# Altium schematic sheet Lithium Battery Charger.SchDoc
size A4; Organization: TESLA Motors, INC; Address1: 3500 Deer Creek Road; Address2: Palo Alto, CA; Address4: U.S.A.; SheetNumber: 5; SheetTotal: 21
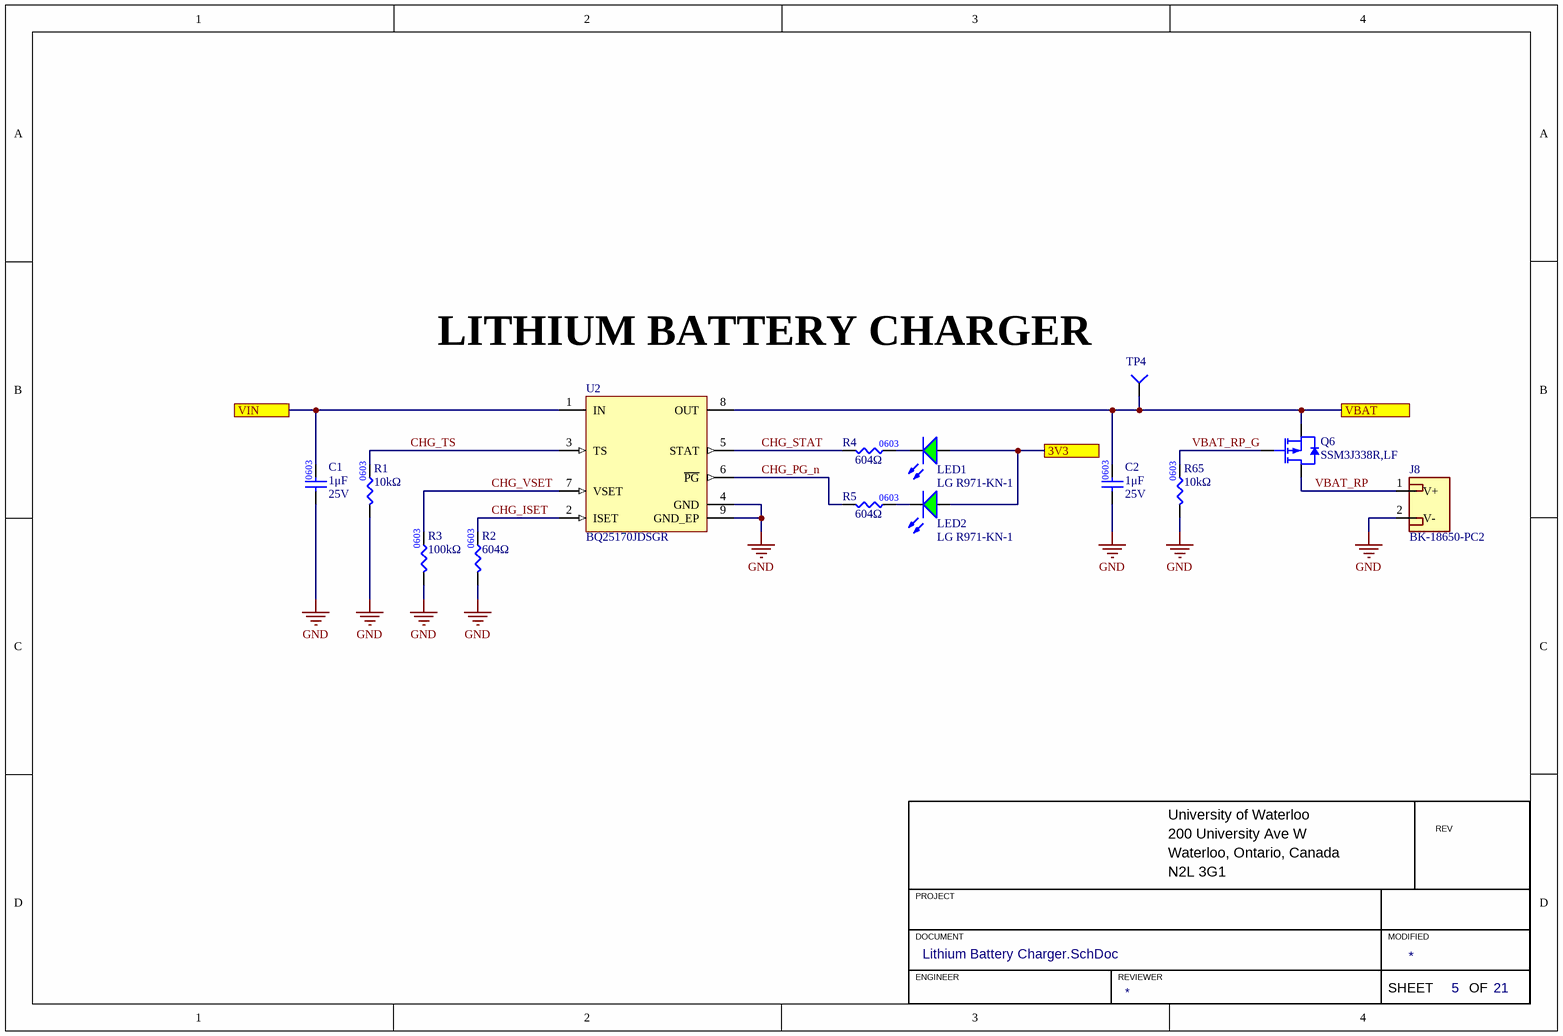
[diagram p0: Lithium Battery Charger.SchDoc]

## Parts
C1  value 1μF  Voltage Rating: 25V  [CAP0603]  (hidden comment: CAP_1uF_25V_0603)
C2  value 1μF  Voltage Rating: 25V  [CAP0603]  (hidden comment: CAP_1uF_25V_0603)
J8  Manufacturer Part Number 1: BK-18650-PC2  [MPD_18650-PC2]  (hidden comment: CON_2POS_XT90)
LED1  Manufacturer Part Number 1: LG R971-KN-1  [LED_0805_GREEN]  (hidden comment: LED_GREEN_0805)
LED2  Manufacturer Part Number 1: LG R971-KN-1  [LED_0805_GREEN]  (hidden comment: LED_GREEN_0805)
Q6  Manufacturer Part Number 1: SSM3J338R,LF  [DIO-INC_SOT23]  (hidden comment: PMOS_12V_6A)
R1  value 10kΩ  [RES0603]  (hidden comment: RES_10kΩ_0603_1%)
R2  value 604Ω  [RES0603]  (hidden comment: RES_604Ω_0603_1%)
R3  value 100kΩ  [RES0603]  (hidden comment: RES_100kΩ_0603_1%)
R4  value 604Ω  [RES0603]  (hidden comment: RES_604Ω_0603_1%)
R5  value 604Ω  [RES0603]  (hidden comment: RES_604Ω_0603_1%)
R65  value 10kΩ  [RES0603]  (hidden comment: RES_10kΩ_0603_1%)
TP4  TESTPOINT_KEYSTONE_LOOP  [KEYSTONE_5019]  (value not drawn)
U2  BQ25170JDSGR  [TI_8-WSON]

## Ports
3V3, VBAT, VIN

## Nets
GND: C1.1 C2.1 J8.2(V-) R1.1 R2.1 R3.1 R65.1 U2.4(GND) U2.9(GND_EP)
3V3: LED1.1(A) LED2.1(A) ; port 3V3
CHG_ISET: R2.2 U2.2(ISET)
CHG_PG_n: R5.1 U2.6(~{PG})
CHG_STAT: R4.1 U2.5(STAT)
CHG_TS: R1.2 U2.3(TS)
CHG_VSET: R3.2 U2.7(VSET)
VBAT: C2.2 Q6.2(Source) TP4.1(=value) U2.8(OUT) ; port VBAT
VBAT_RP: J8.1(V+) Q6.3(Drain)
VBAT_RP_G: Q6.1(Gate) R65.2
VIN: C1.2 U2.1(IN) ; port VIN
NetLED1_2: LED1.2(K) R4.2
NetLED2_2: LED2.2(K) R5.2

## Notes on the sheet
- LITHIUM BATTERY CHARGER
- University of Waterloo
- 200 University Ave W
- REV
- PROJECT
- Waterloo, Ontario, Canada
- N2L 3G1
- DOCUMENT
- ENGINEER
- REVIEWER
- MODIFIED
- SHEET
- OF
- (in symbol RES_100kΩ_0603_1%) 0603
- (in symbol RES_604Ω_0603_1%) 0603

## Library data of the parts
C1 C2 = CAP_1uF_25V_0603: CAP CER 1UF 25V X5R 0603; Manufacturer 1: Samsung; Manufacturer Part Number 1: CL10A105KA8NNNC; Supplier 1: Digi-Key; Mounting Type: SMD; Package: 0603; Supplier Part Number 1: 1276-1102-1-ND; Dielectric: X5R
J8 = CON_2POS_18650: BATTERY HOLDER 18650 PC PIN; Manufacturer 1: MPD (Memory Protection Devices); Mounting Type: TH; Supplier 1: Digi-Key; Supplier Part Number 1: BK-18650-PC2-ND
LED1 LED2 = LED_GREEN_0805: LED GREEN DIFFUSED 0805 SMD; Manufacturer 1: OSRAM; Forward Voltage Drop: 2.2V; Package/Footprint: 0805; Supplier Part Number 1: 475-1410-1-ND; Supplier 1: Digi-Key; Mounting Type: SMD
Q6 = PMOS_12V_6A: MOSFET P-CH 12V 6A SOT23F; Manufacturer 1: Toshiba Semiconductor and Storage; Supplier 1: Digi-Key; Supplier Part Number 1: SSM3J338RLFCT-ND
R1 R65 = RES_10kΩ_0603_1%: RES 10K OHM 1% 1/8W 0603; Manufacturer 1: Stackpole Electronics Inc; Manufacturer Part Number 1: RNCP0603FTD10K0; Supplier Part Number 1: RNCP0603FTD10K0CT-ND; Supplier 1: Digi-Key; Mounting Type: SMD; Package: 0603
R2 R4 R5 = RES_604Ω_0603_1%: RES 604 OHM 1% 1/10W 0603; Manufacturer 1: Yageo; Manufacturer Part Number 1: RC0603FR-07604RL; Supplier Part Number 1: 311-604HRCT-ND; Supplier 1: Digi-Key
R3 = RES_100kΩ_0603_1%: RES 100K OHM 1% 1/10W 0603; Manufacturer 1: Yageo; Manufacturer Part Number 1: RC0603FR-07100KL; Supplier Part Number 1: 311-100KHRCT-ND; Supplier 1: Digi-Key
TP4 = TESTPOINT_KEYSTONE_LOOP: PC TEST POINT MINIATURE; Manufacturer 1: Keystone Electronics; Manufacturer Part Number 1: 5019; Package/Footprint: SMD; Supplier 1: Digi-Key; Mounting Type: SMD; Supplier Part Number 1: 36-5019CT-ND
U2 = BQ25170JDSGR: IC BATTERY MANAGEMENT; Manufacturer 1: Texas Instruments; Package/Footprint: 8-WFDFN; Supplier 1: Digi-Key; Supplier Part Number 1: 296-BQ25170JDSGRCT-ND; Manufacturer Part Number 1: BQ25170JDSGR